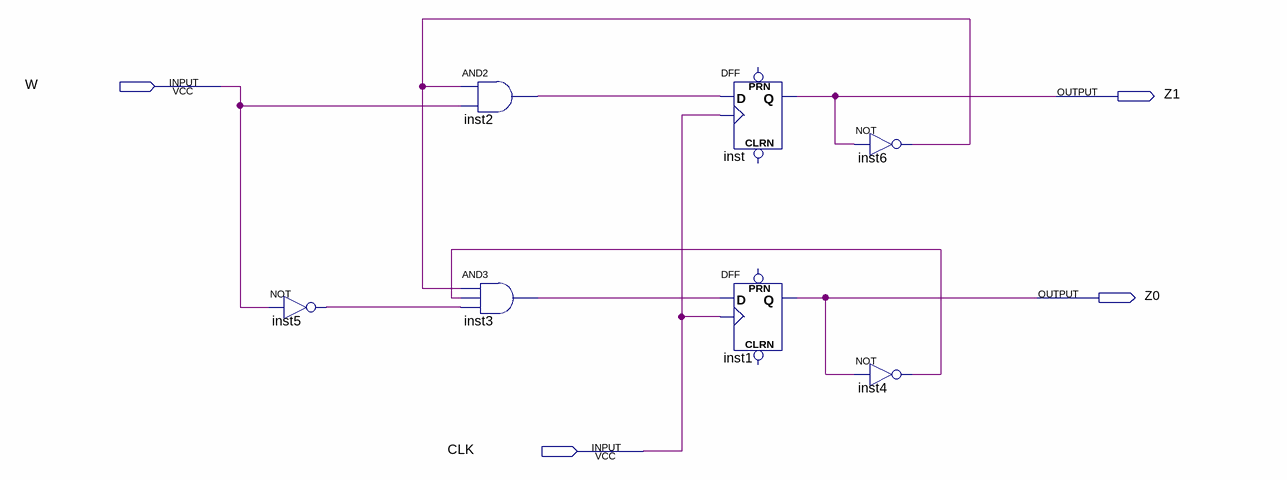
[diagram p0: schematic sheet]
// Quartus schematic FSM.bdf as structural Verilog: 7 symbols, 4 pins
module FSM (
  input  W,
  input  CLK,
  output Z1,
  output Z0
);

  wire inst2_out, inst3_out, inst4_out, inst5_out, inst6_out;

  not inst5 (inst5_out, W);
  and inst2 (inst2_out, inst6_out, W);
  and inst3 (inst3_out, inst6_out, inst4_out, inst5_out);
  DFF inst (.CLK(CLK), .D(inst2_out), .Q(Z1));  // open: CLRN, PRN
  DFF inst1 (.CLK(CLK), .D(inst3_out), .Q(Z0));  // open: CLRN, PRN
  not inst6 (inst6_out, Z1);
  not inst4 (inst4_out, Z0);
endmodule
